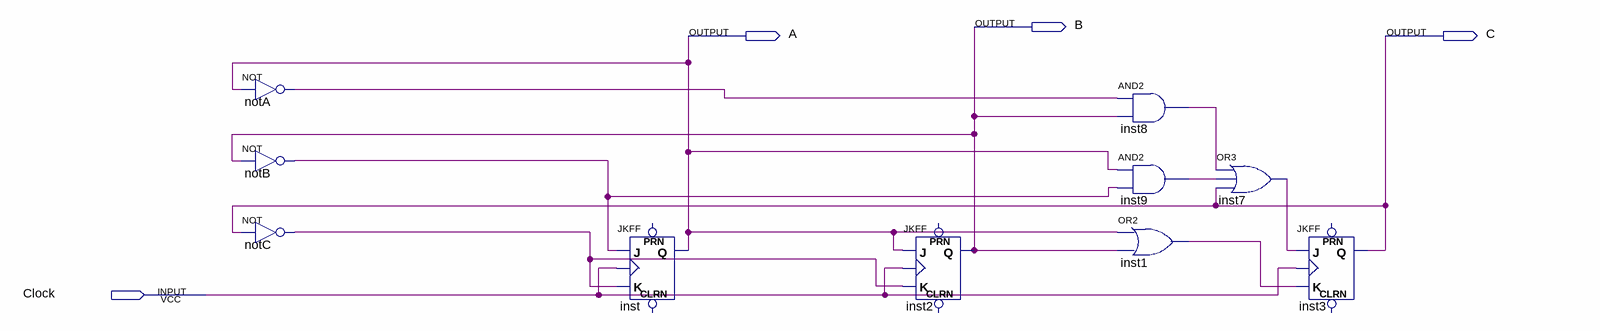
[diagram p0: schematic sheet]
// Quartus schematic project2.bdf as structural Verilog: 10 symbols, 4 pins
module project2 (
  input  Clock,
  output B,
  output A,
  output C
);

  wire inst1_out, inst7_out, inst8_out, inst9_out, notA_out, notB_out, notC_out;

  not notA (notA_out, A);
  not notB (notB_out, B);
  not notC (notC_out, C);
  JKFF inst (.K(notC_out), .J(notB_out), .CLK(Clock), .Q(A));  // open: PRN, CLRN
  JKFF inst2 (.K(notC_out), .J(A), .CLK(Clock), .Q(B));  // open: PRN, CLRN
  and inst8 (inst8_out, notA_out, B);
  and inst9 (inst9_out, A, notB_out);
  or inst1 (inst1_out, A, B);
  or inst7 (inst7_out, inst8_out, inst9_out, C);
  JKFF inst3 (.K(inst1_out), .J(inst7_out), .CLK(Clock), .Q(C));  // open: PRN, CLRN
endmodule
